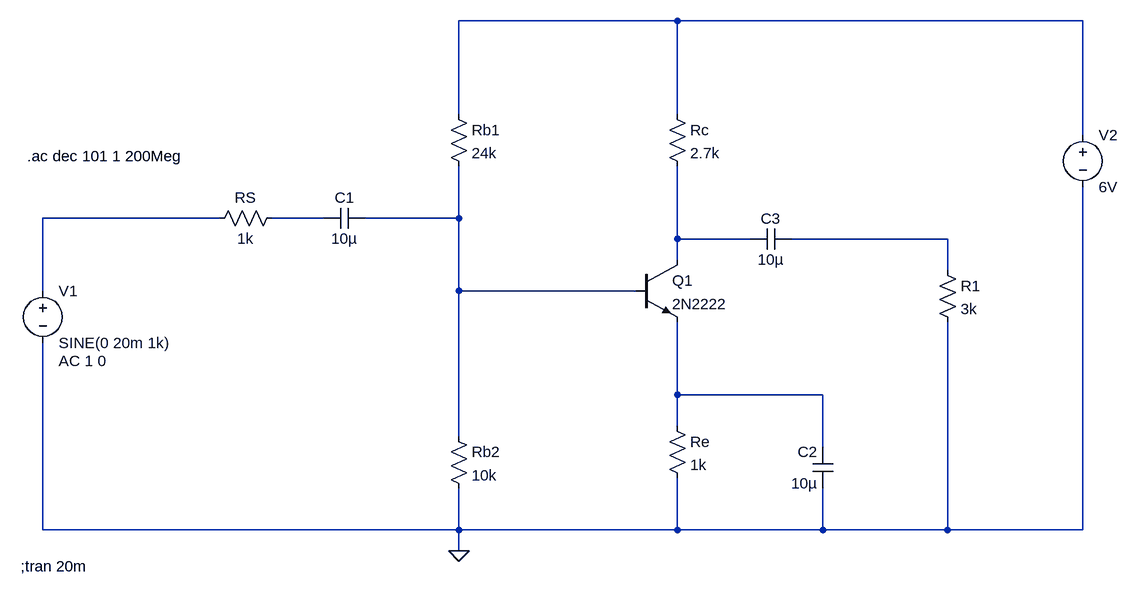
[diagram p0: schematic 硬件实验.asc]
硬件实验.asc, the LTspice schematic file:
Version 4
SHEET 1 1544 680
WIRE 864 -272 528 -272
WIRE 1488 -272 864 -272
WIRE 528 -128 528 -272
WIRE 864 -128 864 -272
WIRE 1488 -96 1488 -272
WIRE 160 32 -112 32
WIRE 320 32 240 32
WIRE 528 32 528 -48
WIRE 528 32 384 32
WIRE 864 64 864 -48
WIRE 976 64 864 64
WIRE 1280 64 1040 64
WIRE 864 96 864 64
WIRE 1280 112 1280 64
WIRE -112 144 -112 32
WIRE 528 144 528 32
WIRE 800 144 528 144
WIRE 864 304 864 192
WIRE 1088 304 864 304
WIRE 864 352 864 304
WIRE 528 368 528 144
WIRE 1088 384 1088 304
WIRE -112 512 -112 224
WIRE 528 512 528 448
WIRE 528 512 -112 512
WIRE 864 512 864 432
WIRE 864 512 528 512
WIRE 1088 512 1088 448
WIRE 1088 512 864 512
WIRE 1280 512 1280 192
WIRE 1280 512 1088 512
WIRE 1488 512 1488 -16
WIRE 1488 512 1280 512
WIRE 528 544 528 512
FLAG 528 544 0
SYMBOL voltage -112 128 R0
WINDOW 123 24 124 Left 2
WINDOW 39 0 0 Left 0
SYMATTR Value2 AC 1 0
SYMATTR InstName V1
SYMATTR Value SINE(0 20m 1k)
SYMBOL voltage 1488 -112 R0
WINDOW 123 0 0 Left 0
WINDOW 39 0 0 Left 0
SYMATTR InstName V2
SYMATTR Value 6V
SYMBOL res 256 16 R90
WINDOW 0 0 56 VBottom 2
WINDOW 3 32 56 VTop 2
SYMATTR InstName RS
SYMATTR Value 1k
SYMBOL res 512 -144 R0
SYMATTR InstName Rb1
SYMATTR Value 24k
SYMBOL res 848 -144 R0
SYMATTR InstName Rc
SYMATTR Value 2.7k
SYMBOL res 512 352 R0
SYMATTR InstName Rb2
SYMATTR Value 10k
SYMBOL res 848 336 R0
SYMATTR InstName Re
SYMATTR Value 1k
SYMBOL cap 384 16 R90
WINDOW 0 0 32 VBottom 2
WINDOW 3 32 32 VTop 2
SYMATTR InstName C1
SYMATTR Value 10µ
SYMBOL cap 1104 448 R180
WINDOW 0 24 56 Left 2
WINDOW 3 24 8 Left 2
SYMATTR InstName C2
SYMATTR Value 10µ
SYMBOL cap 976 80 R270
WINDOW 0 32 32 VTop 2
WINDOW 3 0 32 VBottom 2
SYMATTR InstName C3
SYMATTR Value 10µ
SYMBOL npn 800 96 R0
SYMATTR InstName Q1
SYMATTR Value 2N2222
SYMBOL res 1264 96 R0
SYMATTR InstName R1
SYMATTR Value 3k
TEXT -146 568 Left 2 !;tran 20m
TEXT -136 -64 Left 2 !.ac dec 101 1 200Meg

The netlist it stands for:
* 硬件实验.asc
V1 N002 0 SINE(0 20m 1k) AC 1 0
V2 N001 0 6V
RS N003 N002 1k
Rb1 N001 N004 24k
Rc N001 N005 2.7k
Rb2 N004 0 10k
Re N007 0 1k
C1 N004 N003 10µ
C2 0 N007 10µ
C3 N005 N006 10µ
Q1 N005 N004 N007 0 2N2222
R1 N006 0 3k
.model NPN NPN
.model PNP PNP
.lib standard.bjt
;tran 20m
.ac dec 101 1 200Meg
.backanno
.end